# Altium schematic sheet contactor_control.SchDoc: foxBMS BMS-Master
size A3; DocumentNumber: 16; SheetNumber: 16; SheetTotal: 24; Author: Fraunhofer IISB foxBMS Team; REL-DATE: 2017-05-16; VERSION: 1.0.2; SheetDescription: Contactor Control
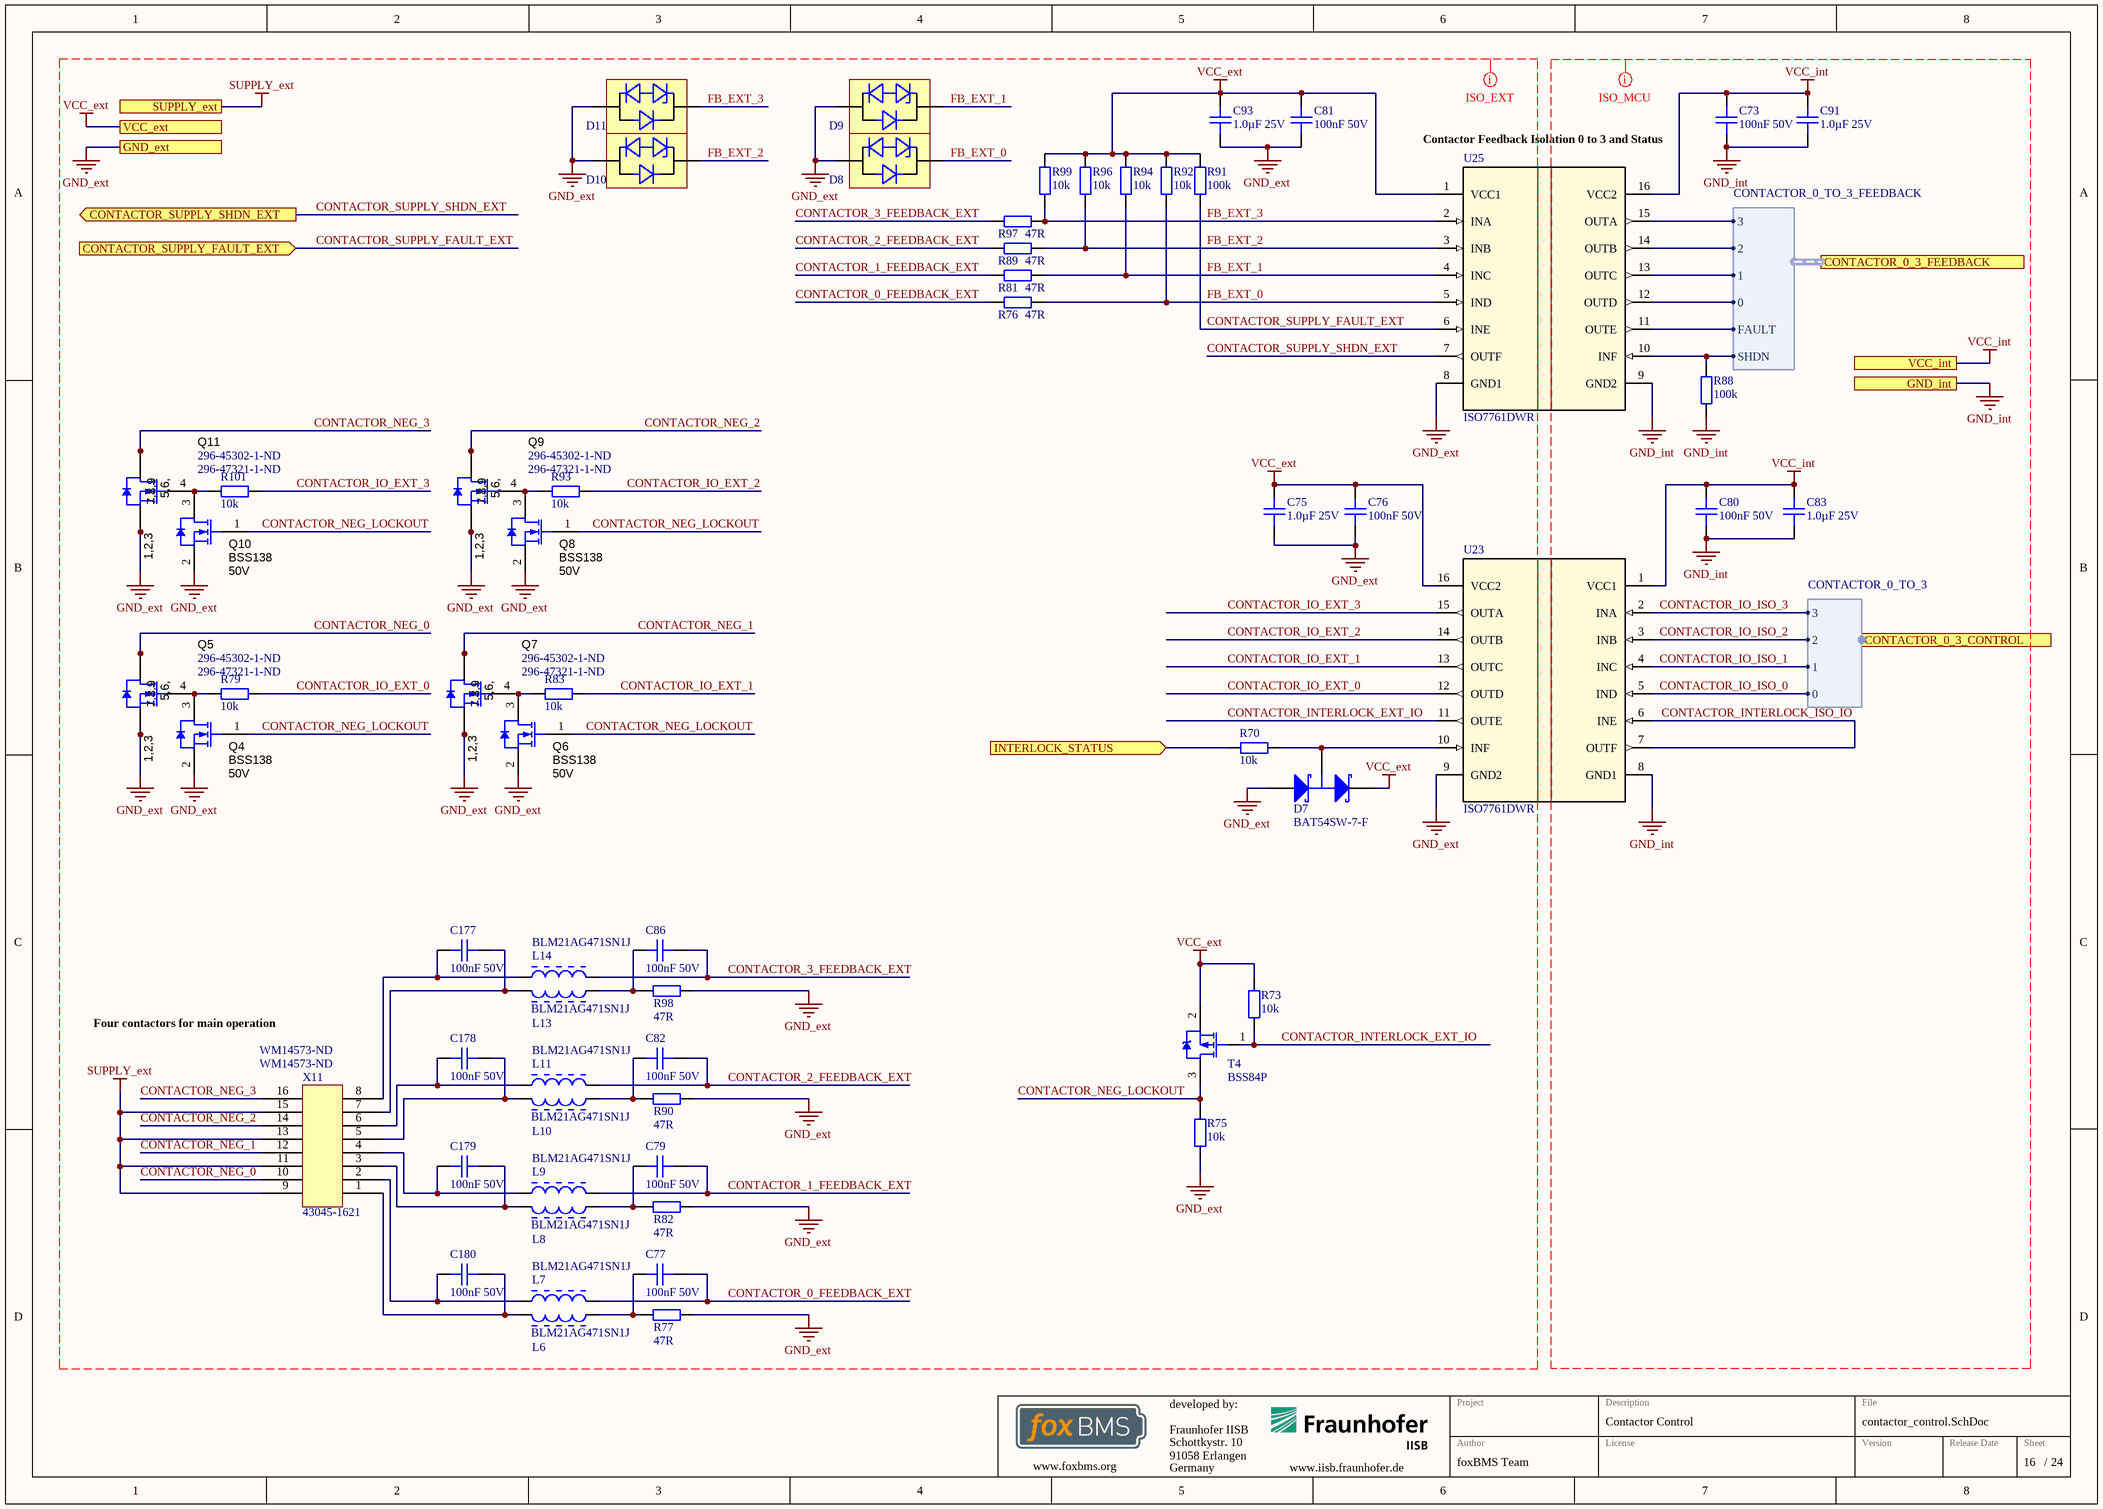
[diagram p0: contactor_control.SchDoc]

## Parts
C73  100nF 50V  [0603C]
C75  1.0µF 25V  [0603C]
C76  100nF 50V  [0603C]
C77  100nF 50V  [0603C]
C79  100nF 50V  [0603C]
C80  100nF 50V  [0603C]
C81  100nF 50V  [0603C]
C82  100nF 50V  [0603C]
C83  1.0µF 25V  [0603C]
C86  100nF 50V  [0603C]
C91  1.0µF 25V  [0603C]
C93  1.0µF 25V  [0603C]
C177  100nF 50V  [0603C]
C178  100nF 50V  [0603C]
C179  100nF 50V  [0603C]
C180  100nF 50V  [0603C]
D7  BAT54SW-7-F  [DIOD-SOT323-3_V]
D8  CDSOD323-T05  [SODFL250X110-2N]  (value not drawn)
D9  CDSOD323-T05  [SODFL250X110-2N]  (value not drawn)
D10  CDSOD323-T05  [SODFL250X110-2N]  (value not drawn)
D11  CDSOD323-T05  [SODFL250X110-2N]  (value not drawn)
L6  BLM21AG471SN1J  [MURA-BLM21-H1-CHIP-2_V]
L7  BLM21AG471SN1J  [MURA-BLM21-H1-CHIP-2_V]
L8  BLM21AG471SN1J  [MURA-BLM21-H1-CHIP-2_V]
L9  BLM21AG471SN1J  [MURA-BLM21-H1-CHIP-2_V]
L10  BLM21AG471SN1J  [MURA-BLM21-H1-CHIP-2_V]
L11  BLM21AG471SN1J  [MURA-BLM21-H1-CHIP-2_V]
L13  BLM21AG471SN1J  [MURA-BLM21-H1-CHIP-2_V]
L14  BLM21AG471SN1J  [MURA-BLM21-H1-CHIP-2_V]
Q4  BSS138  value 50V  [SOT-23]
Q5  Supplier Part Number 1: 296-45302-1-ND  Supplier Part Number 2: 296-47321-1-ND  [SONQ3A]  (hidden comment: CSD18543Q3A)
Q6  BSS138  value 50V  [SOT-23]
Q7  Supplier Part Number 1: 296-45302-1-ND  Supplier Part Number 2: 296-47321-1-ND  [SONQ3A]  (hidden comment: CSD18543Q3A)
Q8  BSS138  value 50V  [SOT-23]
Q9  Supplier Part Number 1: 296-45302-1-ND  Supplier Part Number 2: 296-47321-1-ND  [SONQ3A]  (hidden comment: CSD18543Q3A)
Q10  BSS138  value 50V  [SOT-23]
Q11  Supplier Part Number 1: 296-45302-1-ND  Supplier Part Number 2: 296-47321-1-ND  [SONQ3A]  (hidden comment: CSD18543Q3A)
R70  10k  [0603R]
R73  10k  [0603R]
R75  10k  [0603R]
R76  47R  [0603R]
R77  47R  [0603R]
R79  10k  [0603R]
R81  47R  [0603R]
R82  47R  [0603R]
R83  10k  [0603R]
R88  100k  [0603R]
R89  47R  [0603R]
R90  47R  [0603R]
R91  100k  [0603R]
R92  10k  [0603R]
R93  10k  [0603R]
R94  10k  [0603R]
R96  10k  [0603R]
R97  47R  [0603R]
R98  47R  [0603R]
R99  10k  [0603R]
R101  10k  [0603R]
T4  BSS84P  [INF-PG-SOT23_N]
U23  ISO7761DWR  [DW0016B_N]
U25  ISO7761DWR  [DW0016B_N]
X11  43045-1621  Supplier Part Number 1: WM14573-ND  [43045-1621]

## Ports
CONTACTOR_0_3_CONTROL (harness CONTACTOR_0_TO_3), CONTACTOR_0_3_FEEDBACK (harness CONTACTOR_0_TO_3_FEEDBACK), CONTACTOR_SUPPLY_FAULT_EXT (in), CONTACTOR_SUPPLY_SHDN_EXT (out), GND_ext, GND_int, INTERLOCK_STATUS (in), SUPPLY_ext, VCC_ext, VCC_int

## Harnesses
CONTACTOR_0_TO_3: 0, 1, 2, 3
CONTACTOR_0_TO_3_FEEDBACK: 0, 1, 2, 3, FAULT, SHDN

## Nets
GND_ext: C75.2 C76.2 C81.2 C93.2 D7.1(A) D8.2(A) D9.2(A) D10.2(A) D11.2(A) Q4.2(S) Q5.1(S) Q5.2(S) Q5.3(S) Q6.2(S) Q7.1(S) Q7.2(S) Q7.3(S) Q8.2(S) Q9.1(S) Q9.2(S) Q9.3(S) Q10.2(S) Q11.1(S) Q11.2(S) Q11.3(S) R75.1 R77.2 R82.2 R90.2 R98.2 U23.9(GND2) U25.8(GND1) ; port GND_ext
GND_int: C73.2 C80.2 C83.2 C91.2 R88.1 U23.8(GND1) U25.9(GND2) ; port GND_int
SUPPLY_ext: X11.9 X11.11 X11.13 X11.15 ; port SUPPLY_ext
VCC_ext: C75.1 C76.1 C81.1 C93.1 D7.2(K) R73.2 R91.2 R92.2 R94.2 R96.2 R99.2 T4.2(SOURCE) U23.16(VCC2) U25.1(VCC1) ; port VCC_ext
VCC_int: C73.1 C80.1 C83.1 C91.1 U23.1(VCC1) U25.16(VCC2) ; port VCC_int
CONTACTOR_0_FEEDBACK_EXT: C77.2 L7.2 R76.1
CONTACTOR_1_FEEDBACK_EXT: C79.2 L9.2 R81.1
CONTACTOR_2_FEEDBACK_EXT: C82.2 L11.2 R89.1
CONTACTOR_3_FEEDBACK_EXT: C86.2 L14.2 R97.2
CONTACTOR_INTERLOCK_EXT_IO: R73.1 T4.1(GATE) U23.11(OUTE)
CONTACTOR_INTERLOCK_ISO_IO: U23.6(INE) U23.7(OUTF)
CONTACTOR_IO_EXT_0: R79.1 U23.12(OUTD)
CONTACTOR_IO_EXT_1: R83.1 U23.13(OUTC)
CONTACTOR_IO_EXT_2: R93.1 U23.14(OUTB)
CONTACTOR_IO_EXT_3: R101.1 U23.15(OUTA)
CONTACTOR_IO_ISO_0: U23.5(IND) ; port CONTACTOR_0_3_CONTROL.0
CONTACTOR_IO_ISO_1: U23.4(INC) ; port CONTACTOR_0_3_CONTROL.1
CONTACTOR_IO_ISO_2: U23.3(INB) ; port CONTACTOR_0_3_CONTROL.2
CONTACTOR_IO_ISO_3: U23.2(INA) ; port CONTACTOR_0_3_CONTROL.3
CONTACTOR_NEG_0: Q5.5(D) Q5.6(D) Q5.7(D) Q5.8(D) Q5.9(D) X11.10
CONTACTOR_NEG_1: Q7.5(D) Q7.6(D) Q7.7(D) Q7.8(D) Q7.9(D) X11.12
CONTACTOR_NEG_2: Q9.5(D) Q9.6(D) Q9.7(D) Q9.8(D) Q9.9(D) X11.14
CONTACTOR_NEG_3: Q11.5(D) Q11.6(D) Q11.7(D) Q11.8(D) Q11.9(D) X11.16
CONTACTOR_NEG_LOCKOUT: Q4.1(G) Q6.1(G) Q8.1(G) Q10.1(G) R75.2 T4.3(DRAIN)
CONTACTOR_SUPPLY_FAULT_EXT: R91.1 U25.6(INE) ; port CONTACTOR_SUPPLY_FAULT_EXT
CONTACTOR_SUPPLY_SHDN_EXT: U25.7(OUTF) ; port CONTACTOR_SUPPLY_SHDN_EXT
FB_EXT_0: D8.1(K) R76.2 R92.1 U25.5(IND)
FB_EXT_1: D9.1(K) R81.2 R94.1 U25.4(INC)
FB_EXT_2: D10.1(K) R89.2 R96.1 U25.3(INB)
FB_EXT_3: D11.1(K) R97.1 R99.1 U25.2(INA)
INTERLOCK_STATUS: R70.2 ; port INTERLOCK_STATUS
NetC77_1: C77.1 L6.2 R77.1
NetC79_1: C79.1 L8.2 R82.1
NetC82_1: C82.1 L10.2 R90.1
NetC86_1: C86.1 L13.2 R98.1
NetC177_1: C177.1 L14.1 X11.8
NetC177_2: C177.2 L13.1 X11.7
NetC178_1: C178.1 L11.1 X11.6
NetC178_2: C178.2 L10.1 X11.5
NetC179_1: C179.1 L9.1 X11.4
NetC179_2: C179.2 L8.1 X11.3
NetC180_1: C180.1 L7.1 X11.2
NetC180_2: C180.2 L6.1 X11.1
NetD7_3: D7.3(C) R70.1 U23.10(INF)
NetQ4_3: Q4.3(D) Q5.4(G) R79.2
NetQ6_3: Q6.3(D) Q7.4(G) R83.2
NetQ8_3: Q8.3(D) Q9.4(G) R93.2
NetQ10_3: Q10.3(D) Q11.4(G) R101.2
NetR88_2: R88.2 U25.10(INF) ; port CONTACTOR_0_3_FEEDBACK.SHDN
NetU25_11: U25.11(OUTE) ; port CONTACTOR_0_3_FEEDBACK.FAULT
NetU25_12: U25.12(OUTD) ; port CONTACTOR_0_3_FEEDBACK.0
NetU25_13: U25.13(OUTC) ; port CONTACTOR_0_3_FEEDBACK.1
NetU25_14: U25.14(OUTB) ; port CONTACTOR_0_3_FEEDBACK.2
NetU25_15: U25.15(OUTA) ; port CONTACTOR_0_3_FEEDBACK.3

## Layout directives
net class ISO_MCU: CONTACTOR_INTERLOCK_ISO_IO, CONTACTOR_IO_ISO_0, CONTACTOR_IO_ISO_1, CONTACTOR_IO_ISO_2, CONTACTOR_IO_ISO_3, GND_int, VCC_int
net class ISO_EXT: CONTACTOR_0_FEEDBACK_EXT, CONTACTOR_1_FEEDBACK_EXT, CONTACTOR_2_FEEDBACK_EXT, CONTACTOR_3_FEEDBACK_EXT, CONTACTOR_INTERLOCK_EXT_IO, CONTACTOR_IO_EXT_0, CONTACTOR_IO_EXT_1, CONTACTOR_IO_EXT_2, CONTACTOR_IO_EXT_3, CONTACTOR_NEG_0, CONTACTOR_NEG_1, CONTACTOR_NEG_2, CONTACTOR_NEG_3, CONTACTOR_NEG_LOCKOUT, CONTACTOR_SUPPLY_FAULT_EXT, CONTACTOR_SUPPLY_SHDN_EXT, FB_EXT_0, FB_EXT_1, FB_EXT_2, FB_EXT_3, GND_ext, SUPPLY_ext, VCC_ext

## Notes on the sheet
- (near C73) Contactor Feedback Isolation 0 to 3 and Status
- Four contactors for main operation
- Fraunhofer IISB
- Schottkystr. 10
- developed by:
- 91058 Erlangen
- Germany
- Author
- Project
- License
- Description
- File
- Version
- Release Date
- Sheet
- www.foxbms.org
- www.iisb.fraunhofer.de
- foxBMS Team
- /
- (in symbol CSD18543Q3A) 7,8,9; 5,6,; 1,2,3

## Library data of the parts
C73 C76 C77 C79-C82 C86 C177-C180 = gen_C_ceramic_100n_50V_X7R_0603: Ceramic, 100nF, ±10%, 50V, X7R, –55 to 125°C, 0603 (1608),RoHS, Automotive; Part Number: GCJ188R71H104KA12; Manufacturer: Murata; Capacitance: 100n; Case EIA: 0603; Case Metric: 1608; PnP Package: C_0603_10; PnP Value: 100nF/50V/X7R; PnP equipped: x; Automotive Qualified: True; Rated Voltage: 50V; Dielectric: X7R; Supplier 1: Digi-Key; Supplier Part Number 1: 490-5798-1-ND; Height - Seated (Max): 0.8mm; Mounting Type: SurfaceMount,MLCC; Operating Temperature: –55 to 125°C; Series: GCJ; Tolerance: ±10%; Manufacturer_Part_Number: GCJ188R71H104KA12
C75 C83 C91 C93 = gen_C_ceramic_1u_25V_X7R_0603: Ceramic, 1.0µF, ±10%, 25V, X7R, –55 to 125°C, 0603 (1608),RoHS, Automotive; Part Number: GCJ188R71E105KA01; Manufacturer: Murata; Capacitance: 1µF; Case EIA: 0603; Case Metric: 1608; PnP Package: C_0603_10; PnP Value: 1.0µF/25V/X7R; Automotive Qualified: True; Rated Voltage: 25V; Dielectric: X7R; Supplier 1: Digi-Key; Supplier Part Number 1: 490-14409-1-ND; Height - Seated (Max): 0.8mm; Mounting Type: SurfaceMount,MLCC; Operating Temperature: –55 to 125°C; Series: GCJ; Tolerance: ±10%; Manufacturer_Part_Number: GCJ188R71E105KA01
D7 = CMP-2000-05929-1: Schottky Barrier Diode, 30 V, 200 mA, -65 to 125 degC, 3-Pin SOT323, RoHS, Tape and Reel; Unit Weight: 0.000212oz; Ifsm - Forward Surge Current: 0.6A; Vf - Forward Voltage: 1Vat0.1A; Brand: DiodesIncorporated; Pd - Power Dissipation: 200mW; Ir - Reverse Current: 2uAat25V; Type: SurfaceMountSchottkyBarrierDiodeArray; Vrrm - Repetitive Reverse Voltage: 30V; If - Forward Current: 0.2A; trr - Reverse Recovery time: 5ns; Configuration: DualSeries; Minimum Operating Temperature: -65C; Mounting Style: SMD/SMT; Manufacturer URL: http://www.diodes.com/; Mounting Technology: SurfaceMount; Packaging: Reel; Length: 2.2mm; Product Category: SchottkyDiodes&Rectifiers; Datasheet Version: Rev. 15-2, 03/2014; Series: BAT54; Operating Temperature Range: -65Cto+125C; Manufacturer: DiodesIncorporated; Technology: Si; Datasheet URL: http://www.diodes.com/_files/datasheets/ds30065.pdf; Height: 1mm; Width: 1.35mm; Termination Style: SMD/SMT; Maximum Operating Temperature: +125C; Product: SchottkyDiodes; Package / Case: SOT-323; Package Reference: SOT323; RoHS: True; Package Description: 3-Pin Small Outline Transistor, Body 2 x 1.25 mm, Pitch 0.65 mm; Factory Pack Quantity: 3000
D8-D11 = CDSOD323-T05: TVS Diode, CDSOD323 Series, Unidirectional, 5 V, 18.3 V, SOD-323, 2 Pins; Manufacturer: Bourns; Breakdown Voltage: 6V; Automotive Qualified: False; Part Number: CDSOD323-T05; Part Name: CDSOD323-T05; Operating Temperature: -55°C - +150°C; ComponentLink1Description: Datasheet; ComponentLink1URL: http://www.farnell.com/datasheets/1845299.pdf; Supplier 1: Farnell; Supplier Part Number 1: 2341914
L6-L11 L13 L14 = C5133952-28DE-41F1-874F-4A9C3E40D898: Chip Ferrite Bead for General Signal lines, 470 Ohm, 700 mA, -55 to 125 degC, 2 x 1.25 x 1.05 mm SMD, Tape and Reel; Manufacturer: Murata; DC Resistance: 0.19 Ohm Max.; Impedance (at 100 MHz): 470 Ohm +/- 25%; Rated Current: 700 mA; ComponentLink1URL: http://www.murata.com/; Packing: Tape and Reel; PackageDescription: 2-Pin Chip, Body 2 x 1.25 mm; ComponentLink3Description: Package Specification; Operating Temperature Range: -55 to 125 degC; ComponentLink1Description: Manufacturer URL; PartNumber: BLM21AG471SN1J; DatasheetVersion: 08/2013; Mounting Technology: Surface Mount; ComponentLink2URL: http://www.murata.com/products/catalog/pdf/c31e.pdf; ComponentLink3URL: http://www.murata.com/products/catalog/pdf/c31e.pdf; ComponentLink2Description: Datasheet; PackageReference: BLM21_H1050-2; Part Number: BLM21AG471SN1J
Q4 Q6 Q8 Q10 = BSS138: MOSFET, N-CH, 50V, 0.22A, SOT-23; Manufacturer: Fairchild Semiconductor; Alternate Manufacturer: None; U/M: EA; ChType: N; VdsMax_V: 50; Value1: 6 ohm; Rdson45_Ohm: 6; Value2: 1.7 nC; QgTyp_nC: 1.7; Vgs_V: 20; IdsMax_A: 0.22; ComponentLink1URL: http://www.fairchildsemi.com/ds/BS/BSS138.pdf; SymbolVersion: 2008-07-28; PackageReference: SOT-23; PartNumber: BSS138; ComponentLink1Description: Datasheet link; CompType: MOSFET; RoHS: Y; MountType: SMT; Published: 2008-06-19; Publisher: Texas Instruments; LatestRevisionDate: 2013-07-10; LatestRevisionNote: Added parts.; Supplier 1: Digi-Key; Supplier Part Number 1: BSS138CT-ND; Supplier 2: Mouser; Supplier Part Number 2: 512-BSS138; Supplier 3: Farnell; Supplier Part Number 3: 9845330
Q5 Q7 Q9 Q11 = CSD18543Q3A: 60V, N ch NexFET MOSFET™, single SON3x3, 9.9mOhm; Manufacturer: Texas Instruments; Alternate Manufacturer: None; CompType: MOSFET; Value: 30V; U/M: EA; VdsMax_V: 60; Value1: 0.0081 ohm; Rdson45_Ohm: 0.0081; Value2: 1.7 nC; QgTyp_nC: 1.7; Vgs_V: 10; IdsMax_A: 156; SymbolVersion: 2008-07-09; PartNumber: CSD18543Q3A; PackageReference: SON 3.3x3.3mm; ChType: N; RoHS: Y; MountType: SMT; Published: 2008-06-19; Publisher: Texas Instruments; LatestRevisionDate: 2013-07-24; LatestRevisionNote: Added parts.; ComponentLink1Description: Datasheet link; ComponentLink1URL: http://www.ti.com/lit/ds/symlink/csd18543q3a.pdf; Supplier 1: Digi-Key; Supplier 2: Digi-Key
R70 R73 R75 R79 R83 R92-R94 R96 R99 R101 = gen_R_10k_0603: SMD Resistor 10k 0603; Tolerance: 1%; Power: 0.1W; Case EIA: 0603; Case Metric: 1608; Maximum Working Voltage: 75V; PnP Package: R_0603; Automotive Qualified: False; Part Number: gen_R_10k_0603; Operating Temperature: -55°C - +155°C; Resistance: 10k; Series: E24, E96; PnP Value: 10k; Supplier 1: Farnell; Supplier Part Number 1: 2073349
R76 R77 R81 R82 R89 R90 R97 R98 = gen_R_47R_0603: SMD Resistor 47R 0603; Tolerance: 1%; Power: 0.1W; Case EIA: 0603; Case Metric: 1608; Maximum Working Voltage: 75V; PnP Package: R_0603; Automotive Qualified: False; Part Number: gen_R_47R_0603; Operating Temperature: -55°C - +155°C; Resistance: 47R; Series: E24; PnP Value: 47R; Supplier 1: Farnell; Supplier Part Number 1: 2303030
R88 R91 = gen_R_100k_0603: SMD Resistor 100k 0603; Case EIA: 0603; Case Metric: 1608; PnP Package: R_0603; Automotive Qualified: False; Operating Temperature: -55°C - +155°C; PnP Value: 100k; Part Number: gen_R_100k_0603
T4 = CMP-1099-00028-1: P-Channel SIPMOS Small-Signal-Transistor, -60 V VDS, -0.17 A ID, -55 to 150 degC, PG-SOT23, Reel, Green; Manufacturer: Infineon; VGS(th) (max): -2Â V; VGS(th) (min): -1Â V; VDS (max): -60Â V; Rth: 350Â K/W; Pto t (max): 0.36Â W; ID (max): -0.17Â A; IDpuls (max): -0.68Â A; RDS (on) (max) (@4.5V): 12,000Â mOhm; QG: 1Â nC; Green: TRUE; RDS (on) (max): 8,000Â mOhm; ComponentLink3URL: http://www.infineon.com/dgdl/SOT23-Package_Overview.pdf?folderId=db3a30431936bc4b0119532290053c66&fileId=db3a30431936bc4b0119533468123c85; ComponentLink3Description: Package Specification; Packing: Reel; PartNumber: BSS84P; ComponentLink2Description: Datasheet; Mounting Technology: Surface Mount; ComponentLink2URL: http://www.infineon.com/dgdl/BSS84P_Rev2.7%5B1%5D.pdf?folderId=db3a304314dca38901154a72e3951a65&fileId=db3a304330f68606013118ac7a9b4549; PackageReference: PG-SOT23; ComponentLink1URL: http://www.infineon.com/; PackageVersion: Apr-08; ComponentLink1Description: Manufacturer URL; PackageDescription: 3-Pin Small Outline Transistor Package, 2.9 x 1.3 mm Body, 0.95 mm Pitch; Halogen-free: TRUE; DatasheetVersion: Rev. 2.7
U23 U25 = ISO7761DWR: Imported; Manufacturer: Texas Instruments; PartNumber: ISO7761DWR; RefDes: RefDes; TYPE: TYPE; Value: Value
X11 = molex_microfit_3_08x2_THT: Micro-Fit 3.0 Right Angle Header, 3.00mm Pitch, Dual Row, 16 Circuits, with Snap-in Plastic Peg PCB Lock, Tin, Glow Wire Capable, Black, 43045-1600; Manufacturer: Molex; Circuits: 16; Rated Voltage: 600V; Rated Current: 8.5A; Automotive Qualified: False; Part Number: molex_microfit_3_08x2_THT; Part Name: MicroFit; Operating Temperature: -40°C - +105°C; Supplier 1: Digi-Key; Supplier 2: Digi-Key; Supplier Part Number 2: WM14573-ND